# Altium schematic sheet Support.SchDoc: Gimbal Support Schematic
size Letter; DrawnBy: Aidan Gratton; Organization: UW Robotics; Address1: 200 University Avenue; Address2: Waterloo; Address3: Ontario; Address4: Canada N2L 3G6; SheetNumber: 4; SheetTotal: 5
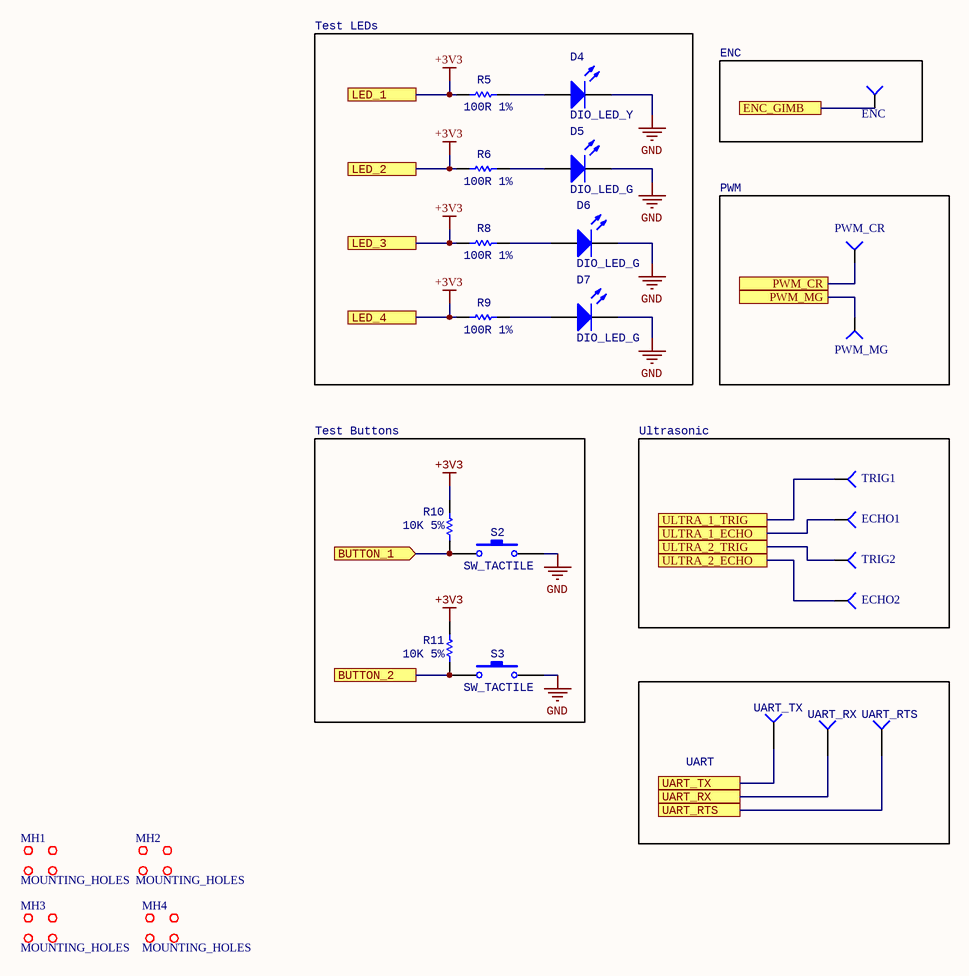
[diagram p0: Support.SchDoc]

## Parts
D4  DIO_LED_Y  [LED_0805_LINE]
D5  DIO_LED_G  [LED_0805_LINE]
D6  DIO_LED_G  [LED_0805_LINE]
D7  DIO_LED_G  [LED_0805_LINE]
MH1  MOUNTING_HOLES  [MOUNTING_HOLE]
MH2  MOUNTING_HOLES  [MOUNTING_HOLE]
MH3  MOUNTING_HOLES  [MOUNTING_HOLE]
MH4  MOUNTING_HOLES  [MOUNTING_HOLE]
R5  value 100R 1%  [RESC0603(1608)_N]  (hidden comment: RES_100R_0603)
R6  value 100R 1%  [RESC0603(1608)_N]  (hidden comment: RES_100R_0603)
R8  value 100R 1%  [RESC0603(1608)_N]  (hidden comment: RES_100R_0603)
R9  value 100R 1%  [RESC0603(1608)_N]  (hidden comment: RES_100R_0603)
R10  value 10K 5%  [RESC0603(1608)_N]  (hidden comment: RES_10K_0603)
R11  value 10K 5%  [RESC0603(1608)_N]  (hidden comment: RES_10K_0603)
S2  SW_TACTILE  [B3U-1100P]
S3  SW_TACTILE  [B3U-1100P]
TP8  TRIG1  [TESTPOINT]
TP9  PWM_CR  [TESTPOINT]
TP10  ENC  [TESTPOINT]
TP11  ECHO1  [TESTPOINT]
TP12  TRIG2  [TESTPOINT]
TP13  ECHO2  [TESTPOINT]
TP14  PWM_MG  [TESTPOINT]
UART_RTS  TESTPOINT  (value not drawn)
UART_RX  TESTPOINT  (value not drawn)
UART_TX  TESTPOINT  (value not drawn)

## Blocks framed on the sheet
Test LEDs: D4-D7 R5 R6 R8 R9
ENC: TP10
PWM: TP9 TP14
Test Buttons: R10 R11 S2 S3
Ultrasonic: TP8 TP11-TP13
UART: UART_RTS UART_RX UART_TX

## Ports
BUTTON_1 (in), BUTTON_2, ENC_GIMB, LED_1, LED_2, LED_3, LED_4, PWM_CR, PWM_MG, UART_RTS, UART_RX, UART_TX, ULTRA_1_ECHO, ULTRA_1_TRIG, ULTRA_2_ECHO, ULTRA_2_TRIG

## Nets
+3V3: R5.1 R6.1 R8.1 R9.1 R10.1 R11.2 ; port LED_1, port LED_2, port LED_3, port LED_4
GND: D4.2(K) D5.2(K) D6.2(K) D7.2(K) S2.2 S3.2
BUTTON_1: R10.2 S2.1 ; port BUTTON_1
BUTTON_2: R11.1 S3.1 ; port BUTTON_2
ENC_GIMB: TP10.1(=value) ; port ENC_GIMB
PWM_CR: TP9.1(=value) ; port PWM_CR
PWM_MG: TP14.1(=value) ; port PWM_MG
UART_RTS: UART_RTS.1(=value) ; port UART_RTS
UART_RX: UART_RX.1(=value) ; port UART_RX
UART_TX: UART_TX.1(=value) ; port UART_TX
ULTRA_1_ECHO: TP11.1(=value) ; port ULTRA_1_ECHO
ULTRA_1_TRIG: TP8.1(=value) ; port ULTRA_1_TRIG
ULTRA_2_ECHO: TP13.1(=value) ; port ULTRA_2_ECHO
ULTRA_2_TRIG: TP12.1(=value) ; port ULTRA_2_TRIG
NetD4_1: D4.1(A) R5.2
NetD5_1: D5.1(A) R6.2
NetD6_1: D6.1(A) R8.2
NetD7_1: D7.1(A) R9.2

## Notes on the sheet
- Title
- Size:
- Date:
- Letter
- Drawn By:
- Sheet
- of
- File:

## Library data of the parts
D4 = DIO_LED_Y: LED YELLOW DIFFUSED 0805 SMD; Manufacturer: OSRAM; MPN: LY R976-PS-36; Forward Voltage Drop: 2.2V; Package: 0805 (2012 Metric); Digikey Part Number: 475-2560-1-ND
D5-D7 = DIO_LED_G: LED GREEN DIFFUSED 0805 SMD; Manufacturer: OSRAM; MPN: LG R971-KN-1; Forward Voltage Drop: 2.2V; Package: 0805 (2012 Metric); Digikey Part Number: 475-1410-1-ND
MH1-MH4 = MOUNTING_HOLES: 6cm x 6cm
R5 R6 R8 R9 = RES_100R_0603: RES SMD 100 OHM 1% 1/10W 0603; Manufacturer: Yageo; MPN: RC0603FR-07100RL; Package: 0603 (1608 Metric); Dimensions: 0.063" L x 0.031" W (1.60mm x 0.80mm); Tolerance: 1%; Digikey Part Number: 311-100HRCT-ND
R10 R11 = RES_10K_0603: RES SMD 10K OHM 5% 1/10W 0603; Manufacturer: Yageo; MPN: RC0603JR-0710KL; Package: 0603 (1608 Metric); Dimensions: 0.063" L x 0.031" W (1.60mm x 0.80mm); Tolerance: 5%; Digikey Part Number: 311-10KGRCT-ND
S2 S3 = SW_TACTILE: Tactile Switch (Grey); Manufacturer: Omron Electronics Inc-EMC Div; Digikey Part Number: SW1021TR-ND; MPN: B3U-1100P
TP8-TP14 = TESTPOINT_SMD: Part Number (MPN): *